# Altium schematic sheet VoltageRegulator.SchDoc
size A4; SheetNumber: 1; SheetTotal: 1
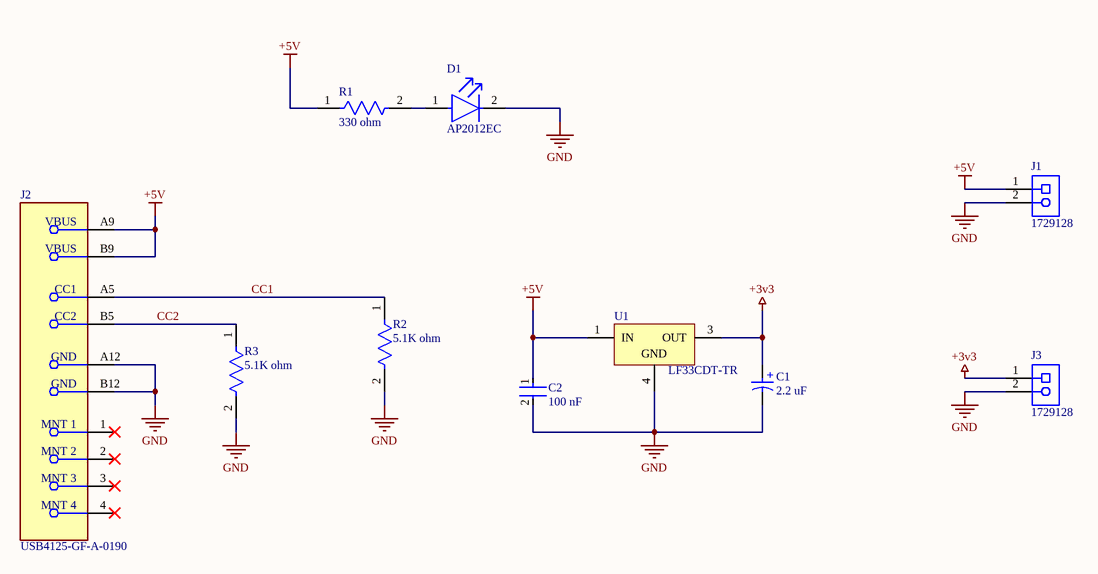
[diagram p0: VoltageRegulator.SchDoc]

## Parts
C1  2.2 uF  [WCAP-ASLI_D4H5.5]
C2  100 nF  [FP-C0805C-DN-MFG]
D1  AP2012EC  [FP-AP2012EC-MFG]
J1  1729128  [PHOE-1729128-2_V]
J2  USB4125-GF-A-0190  [FP-USB4125-GF-A-0190-MFG]
J3  1729128  [PHOE-1729128-2_V]
R1  330 ohm  [FP-RT0805-MFG]
R2  5.1K ohm  [FP-RT0805-MFG]
R3  5.1K ohm  [FP-RT0805-MFG]
U1  LF33CDT-TR  [TO-252_N]

## Nets
+3v3: C1.1(P) J3.1 U1.3(OUT)
+5V: C2.1 J1.1 J2.A9(VBUS) J2.B9(VBUS) R1.1 U1.1(IN)
GND: C1.2(N) C2.2 D1.2(C) J1.2 J2.A12(GND) J2.B12(GND) J3.2 R2.2 R3.2 U1.4(GND)
CC1: J2.A5(CC1) R2.1
CC2: J2.B5(CC2) R3.1
NetD1_1: D1.1(A) R1.2

Not connected (* = marked no-connect by the designer): J2 1(MNT_1)* 2(MNT_2)* 3(MNT_3)* 4(MNT_4)*

## Notes on the sheet
- (in symbol CMP-03913-53914611-1) +

## Library data of the parts
C1 = CMP-03913-53914611-1: 865080640002 WCAP-ASLI Aluminum Electrolytic Capacitors; Material: Aluminium; Life (Hours): 2000hours; Impedance: 4.5Ω; Ripple Current: 55mA; Voltage Rating (DC): 50V; Tolerance: 20%; Capacitance: 2.2µF; Leakage Current: 3µA; Polarity: Polar; ESR (Equivalent Series Resistance): 3.36762Ω; Insulation Resistance: 16.6667MΩ; RoHS: Compliant; Ripple Current (AC): 55mA; Packaging: Tape & Reel (TR); Height: 5.5mm; Mount: Surface Mount; NexarPartId: 53914611; REACH SVHC: Unknown; Max Operating Temperature: 105°C; Min Operating Temperature: -55°C; Voltage Rating: 50V; Height - Seated (Max): 5.5118mm; Width: 4.3mm; Case/Package: Radial; Length: 5.5mm; Diameter: 4mm
C2 = CMP-1036-04423-3: CAP CER 0.1UF 50V X7R 0805; Manufacturer Part Number: C0805C104M5RACTU; Manufacturer: KEMET; Tolerance: 0.2; Temperature Coefficient: 30ppm/°C; Material: Ceramic; Capacitance: 0.10 μF; Value: 0.10 μF; Temperature: -55°C to +125°C; RoHS: TRUE; Temperature Range Low: -55°C; Device Class L3: Ceramic Capacitors; Octopart: https://octopart.com/c0805c104m5ractu-kemet-129379; Ipc Land Pattern Name: CAPC200125X78; Mouser Description: Multilayer Ceramic Capacitors MLCC - SMD/SMT 50volts 0.1uF X7R 20%; Temperature Range High: +125°C; Package: C0805C-DN; Temperature Characteristic: X7R; Automotive: No; ComponentLink2URL: https://content.kemet.com/datasheets/KEM_C1003_C0G_SMD.pdf; Device Class L1: Passive Components; ComponentLink2Description: Datasheet; Device Class L2: Capacitors; Voltage Rating: 50 V; Digikey Description: CAP CER 0.1UF 50V X7R 0805; Lead Free: Yes; Height: 0.88mm; Category: Cap
D1 = CMP-44529-000070-1: LED RED CLEAR SMD; Forward Voltage: 2V; Test Current: 20mA; Luminous Intensity: 15mcd; Viewing Angle: 120°; Wavelength: 627nm; Dominant Wavelength: 625nm; Lead Free: Lead Free; Length: 2mm; Forward Current: 20mA; Mount: Surface Mount; Packaging: Tape and Reel; Illumination Color: Red; Color: Red; Height: 1.1mm; Case Code (Metric): 2012; Case Code (Imperial): 0805; Case/Package: 0805; Width: 1.25mm; RoHS Compliant: Yes; Package Quantity: 2000; Min Operating Temperature: -40°C; Max Operating Temperature: 85°C; Lens Style: Clear
J1 J3 = CMP-2000-05815-1: PCB Terminal Block, 13.5 A, 400 V, 2-Pin THD, RoHS, Bulk; Manufacturer: Phoenix Contact; Package Version: 03/2015; No. of Rows: 1; Pitch: 5.08mm; No. of Positions: 2; Voltage Rating: 400V; Current Rating: 13500mA; Manufacturer URL: http://www.phoenixcontact.com/; Datasheet URL: https://datasheet.ciiva.com/16046/1729128-16046181.pdf; RoHS: TRUE; Package URL: https://www.phoenixcontact.com/online/portal/pi/pxc/product_detail_page/!ut/p/b1/3VdJjqNKFDxLH8AFycySyWY2ozFsEPOMMQaDOX1XedGL_1Vdm5YXJleknhSKeBkvI6EA8ncAo3AYoDhBQGco6KN7VURTdemj9us_IEKEZo_YHiPAEWEFmDGOHMORkqKYCORBZxgL7ZoaZYcbFFUZ3fqxSY6GOuxydWUuHqz1ynmMFygu583Bob0Ewr6Sd_l-5m-kAueHiB0jpRwZwe58wwtkpxtMYd_LmGcDRU02dRNEyWt6Y2ti5pSyJ_reIkzIulrqApdnbT11V5jnCKbYNCvhEM1MCpPByat_X379-iThf08CI5GfOPqfBeS3BRoBOdD55AKVv0iLwCMq-2BrzXWSGRH7pUGD9uwXQjiph3xL0DKQwdGa0JImiIOmBNOestqgwTHSSs2oOep-78apyXQBvNi8ZLaFjvjWvcaUEBu0MC6Wbe-d6mB0FAebo2lUWinqYaZs5DAYzV0RP9yitUjnGJ0iI9xhZkT42OCQNUJJhkgWINNQLP2JFP6OpMg3JCVg70jqHT0lvKOnhHf0lPuOnnLf0VPuWx6_dxwUIvwk5WMkT0kLL1mh61l2yZVSzG3pYV_bqo-mj6uMKwKwdnnW8Jh5RTOJzMOA5c-eJDaZQw4mTMPH02PvS_ZAqNVjVTo2WyYLkwH_KU1mmmG5kjRhDqPXLwwVHvVOjCM60-fpXvTDfMGW1PVFVS1r4e4yVDk4ZdNbkUHvqPqQSeian4UD39fNKmachqdJ1NJbyk8rXT9mXTvPk3oE5meulKGgiruPJek-4I9hTT6G8ZLOyRSm2RRVbThERQad5OS28hdt4YW4vG0stgYYzsWsK4_7y6DZMjJSCqri1kyiZR5vD7pwIrNR7QwPHTcLTI5qT7eRlpHrdGiupYlqQDJ7zy_CND8fWWBoLRXxk1RVcXiBQwbTD4Xi7KL-FuO94t9xaqweXzH; PartNumber: 1729128; Package Description: 2-Pin Through Hole Device, Body 8.1 x 10.16 mm, Pitch 5.08 mm; Datasheet Version: 12/2013; Mounting Technology: ThroughHole; Orientation: Horizontal; Package Reference: 1729128-2; Packing: Bulk
J2 = CMP-245163-000004-1: CONN RCPT TYPE C 6P SMD RA
R1-R3 = CMP-03412-014864-1: RES SMD 604K OHM 0.1% 1/8W 0805; Manufacturer Part Number: RT0805BRD07604KL; Manufacturer: Yageo; Voltage Rating: 150V; Resistance: 604KΩ; Temperature Coefficient: 25 ppm/°C; Tolerance: 0.0025; Power Rating: 0.125W; Value: 604KΩ; Octopart: https://octopart.com/rt0805brd07604kl-yageo-1479051; Digikey Description: RES SMD 604K OHM 0.1% 1/8W 0805; Temperature: -55°C to +155°C; Automotive: No; ComponentLink2Description: Datasheet; Device Class L2: Resistors; Ipc Land Pattern Name: RESC200125X50; Temperature Range High: +155°C; Height: 0.6mm; Package: RT0805; Composition: Thin Film; Temperature Range Low: -55°C; Footprint Url: http://www.yageo.com/exep/pages/download/literatures/PYu-R_Mount_10.pdf; Device Class L3: Chip SMD Resistors; Category: Res; ComponentLink2URL: http://www.yageo.com/documents/recent/PYu-RT_1-to-0.01_RoHS_L_9.pdf; Mouser Description: Thin Film Resistors - SMD 604K ohm 0.1% 1/8W; Device Class L1: Passive Components; Lead Free: Yes; Series: RT; RoHS: TRUE
U1 = CMP-0244-00069-1: 500mA, Very Low Drop (0.45V) Voltage Regulator, 3.3V, 3-Pin DPAK, Tape and Reel; ComponentLink1URL: http://www.st.com; PackageDescription: 3-Pin Transistor Outline Package 2.28 mm Pitch, 9.7 mm Lead Span (DPAK); ComponentLink2Description: Datasheet; ComponentLink1Description: Manufacturer URL; PackageReference: TO-252; DatasheetVersion: 1/11/2010; ComponentLink2URL: http://www.st.com/internet/com/TECHNICAL_RESOURCES/TECHNICAL_LITERATURE/DATASHEET/CD00000546.pdf; PackageVersion: 2011